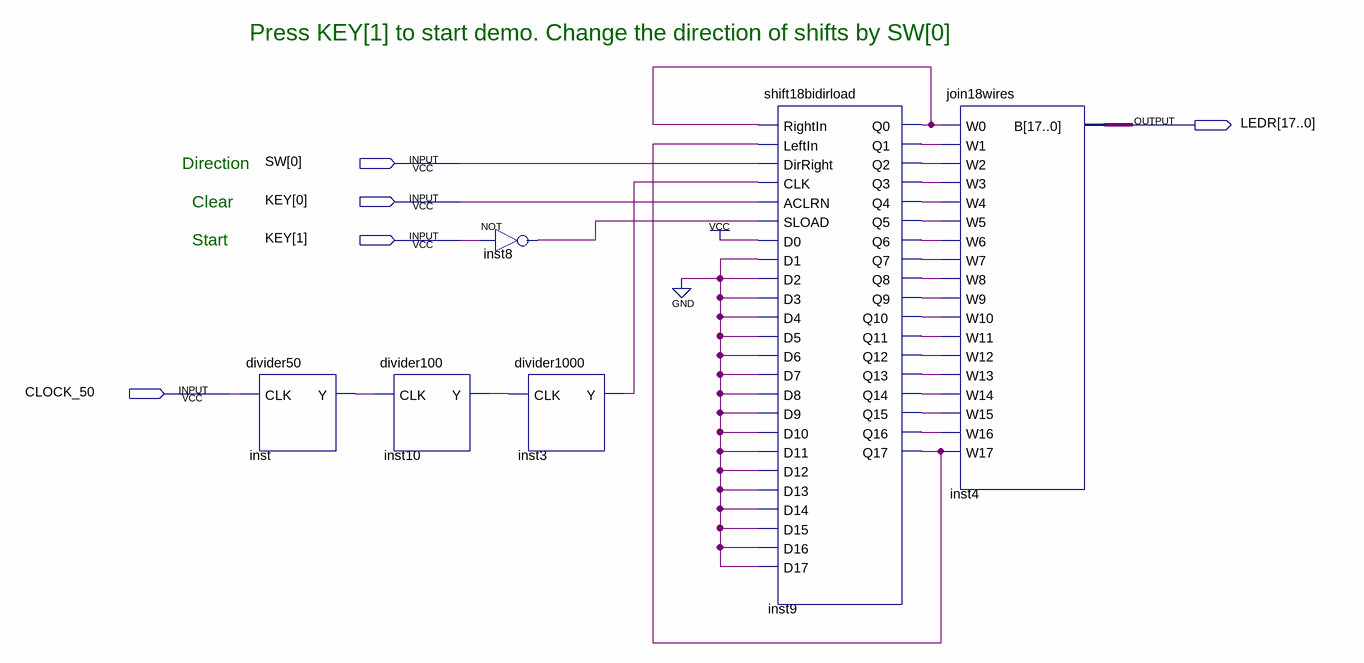
[diagram p0: schematic sheet]
// Quartus schematic test_shift18bi.bdf as structural Verilog: 6 symbols, 5 pins
module test_shift18bi (
  input  [0:0] SW,
  input  [1:0] KEY,
  input  CLOCK_50,
  output [17:0] LEDR
);

  wire inst3_y, inst8_out, inst9_q0, inst9_q1, inst9_q2, inst9_q3, inst9_q4, inst9_q5, inst9_q6, inst9_q7,
       inst9_q8, inst9_q9, inst9_q10, inst9_q11, inst9_q12, inst9_q13, inst9_q14, inst9_q15, inst9_q16,
       inst9_q17, inst10_y, inst_y;

  divider50 inst (.CLK(CLOCK_50), .Y(inst_y));
  divider100 inst10 (.CLK(inst_y), .Y(inst10_y));
  not inst8 (inst8_out, KEY[1]);
  divider1000 inst3 (.CLK(inst10_y), .Y(inst3_y));
  shift18bidirload inst9 (
    .RightIn(inst9_q0), .LeftIn(inst9_q17), .DirRight(SW[0]), .CLK(inst3_y), .ACLRN(KEY[0]),
    .SLOAD(inst8_out), .D0(1'b1), .D1(1'b0), .D2(1'b0), .D3(1'b0), .D4(1'b0), .D5(1'b0), .D6(1'b0),
    .D7(1'b0), .D8(1'b0), .D9(1'b0), .D10(1'b0), .D11(1'b0), .D12(1'b0), .D13(1'b0), .D14(1'b0), .D15(1'b0),
    .D16(1'b0), .D17(1'b0), .Q0(inst9_q0), .Q1(inst9_q1), .Q2(inst9_q2), .Q3(inst9_q3), .Q4(inst9_q4),
    .Q5(inst9_q5), .Q6(inst9_q6), .Q7(inst9_q7), .Q8(inst9_q8), .Q9(inst9_q9), .Q10(inst9_q10),
    .Q11(inst9_q11), .Q12(inst9_q12), .Q13(inst9_q13), .Q14(inst9_q14), .Q15(inst9_q15), .Q16(inst9_q16),
    .Q17(inst9_q17));
  join18wires inst4 (
    .W0(inst9_q0), .W1(inst9_q1), .W2(inst9_q2), .W3(inst9_q3), .W4(inst9_q4), .W5(inst9_q5), .W6(inst9_q6),
    .W7(inst9_q7), .W8(inst9_q8), .W9(inst9_q9), .W10(inst9_q10), .W11(inst9_q11), .W12(inst9_q12),
    .W13(inst9_q13), .W14(inst9_q14), .W15(inst9_q15), .W16(inst9_q16), .W17(inst9_q17), .B(LEDR));

  // Notes on the sheet:
  //   Press KEY[1] to start demo. Change the direction of shifts by SW[0]
  //   Direction
  //   Clear
  //   Start
endmodule
